# EAGLE design Wheatstone (EAGLE 9.6.2)
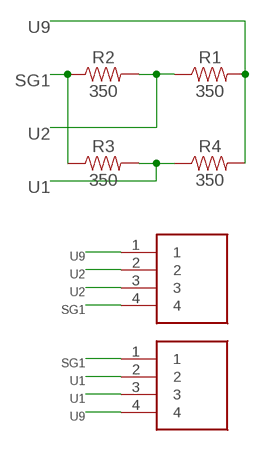
[diagram p0: schematic, sheet 1]

## Parts
J1  1725672  [1725672-4-2.54]
J2  1725672  [1725672-4-2.54]
R1  350  330OHM-HORIZ-1/10W-5%  [AXIAL-0.3]
R2  350  330OHM-HORIZ-1/10W-5%  [AXIAL-0.3]
R3  350  330OHM-HORIZ-1/10W-5%  [AXIAL-0.3]
R4  350  330OHM-HORIZ-1/10W-5%  [AXIAL-0.3]

## Nets
SG1: J1.4 J2.1 R2.P$1 R3.P$1
U1: J2.2 J2.3 R3.P$2 R4.P$1
U2: J1.2 J1.3 R1.P$1 R2.P$2
U9: J1.1 J2.4 R1.P$2 R4.P$2

## Library data of the parts
J1 J2 = Backplate_2:1725672: 4 way vertical PCB terminal,6A 63V Phoenix Contact Non-Fused Terminal Block, 4 Way, Solder Terminals, 26 ??? 20 AWG Through Hole, Nylon, 63 V Source: Datasheet <https://www.phoenixcontact.com/online/portal/us?uri=pxc-oc-itemdetail:pid=1725672&library=usen&tab=1.pdf>; ALLIED_NUMBER: 70054337; DESCRIPTION: 4 way vertical PCB terminal,6A 63V Phoenix Contact Non-Fused Terminal Block, 4 Way, Solder Terminals, 26 ??? 20 AWG Through Hole, Nylon, 63 V; HEIGHT: mm; MANUFACTURER_NAME: Phoenix Contact; MANUFACTURER_PART_NUMBER: 1725672; RS_PART_NUMBER: 3924476; RS_PRICE-STOCK: https://uk.rs-online.com/web/p/products/3924476
R1-R4 = SparkFun-Resistors:330OHM: 330Ω resistor A resistor is a passive two-terminal electrical component that implements electrical resistance as a circuit element. Resistors act to reduce current flow, and, at the same time, act to lower voltage levels within circuits. - Wikipedia; PROD_ID: RES-8371; VALUE: 330

## Net classes
0 default: width 0.203 mm

## Board
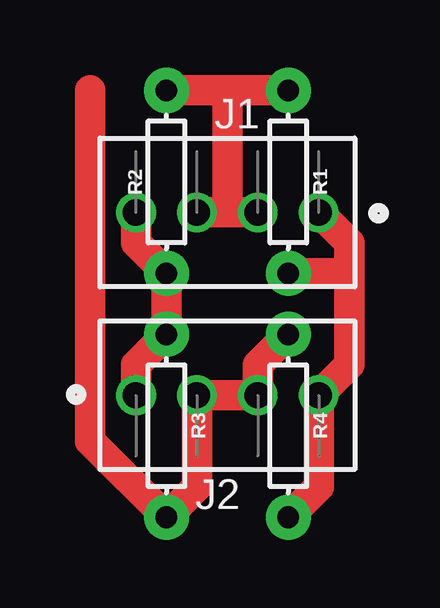
[diagram p1: board, top side]
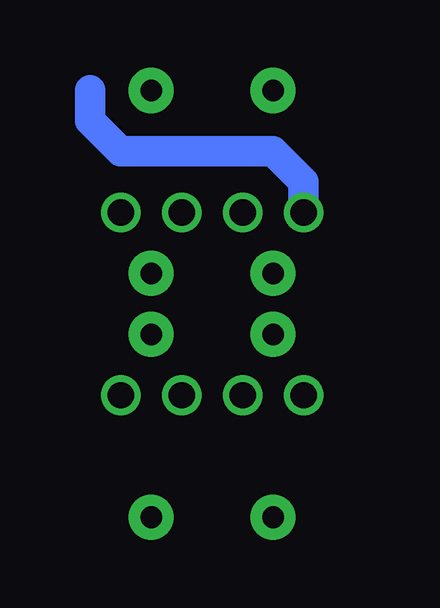
[diagram p2: board, bottom side, seen from below]

No outline drawn. Coordinates in mm, seen from the top.
Copper layers (1*16): Top 0.035mm / dielectric 1.5mm / Bottom 0.035mm
Design rules "default": minimum track width 6mil, minimum drill 0.35mm, track to track 6mil, track to pad 6mil, pad to pad 6mil, via to via 6mil, smd to smd 6mil, copper to edge 40mil, drill to drill 6mil, minimum pad ring 10mil, minimum via ring 8mil, stop-mask expansion 4mil, vias tented up to drill 0mil, thermal gap 10mil

### Footprints (pad centres in the part's own frame; a part is rotated, then mirrored left to right if it is on the bottom)
1725672-4-2.54 = drill 1.1 pad 1.65: 1 0,0; 2 2.54,0; 3 5.08,0; 4 7.62,0
AXIAL-0.3 = drill 0.9 pad 1.88: P$1 -3.81,0; P$2 3.81,0

### Placement (x,y rotation side)
J1  11.43,45.72 180 top
J2  3.81,38.1 0 top
R1  10.16,46.99 270 top
R2  5.08,46.99 90 top
R3  5.08,36.83 270 top
R4  10.16,36.83 270 top

### Tracks (layer width: path | path; a pad name or v marks a point on that pad's centre or on a via)
SG1
  Top 1.27: J2.1 3.81,39.37 R3.P$1 R2.P$1 3.81,44.45 J1.4
  Bottom 1.27: J1.4 3.81,46.99 5.08,48.26 11.43,48.26 12.7,49.53 12.7,50.8
U1
  Top 1.27: R4.P$1 8.89,39.37 J2.3 J2.2 6.35,34.29 R3.P$2 1.91,36.2 1.91,50.8
U2
  Top 1.27: J1.3 7.62,45.72 | 7.62,45.72 J1.2 | R2.P$2 7.62,50.8 | 7.62,50.8 R1.P$1 | 7.62,45.72 7.62,50.8
U9
  Top 1.27: R4.P$2 11.43,34.29 J2.4 12.7,39.37 12.7,43.18 | J1.1 12.7,44.45 12.7,43.18 | R1.P$2 12.7,43.18